# EAGLE design main (EAGLE 6.3)
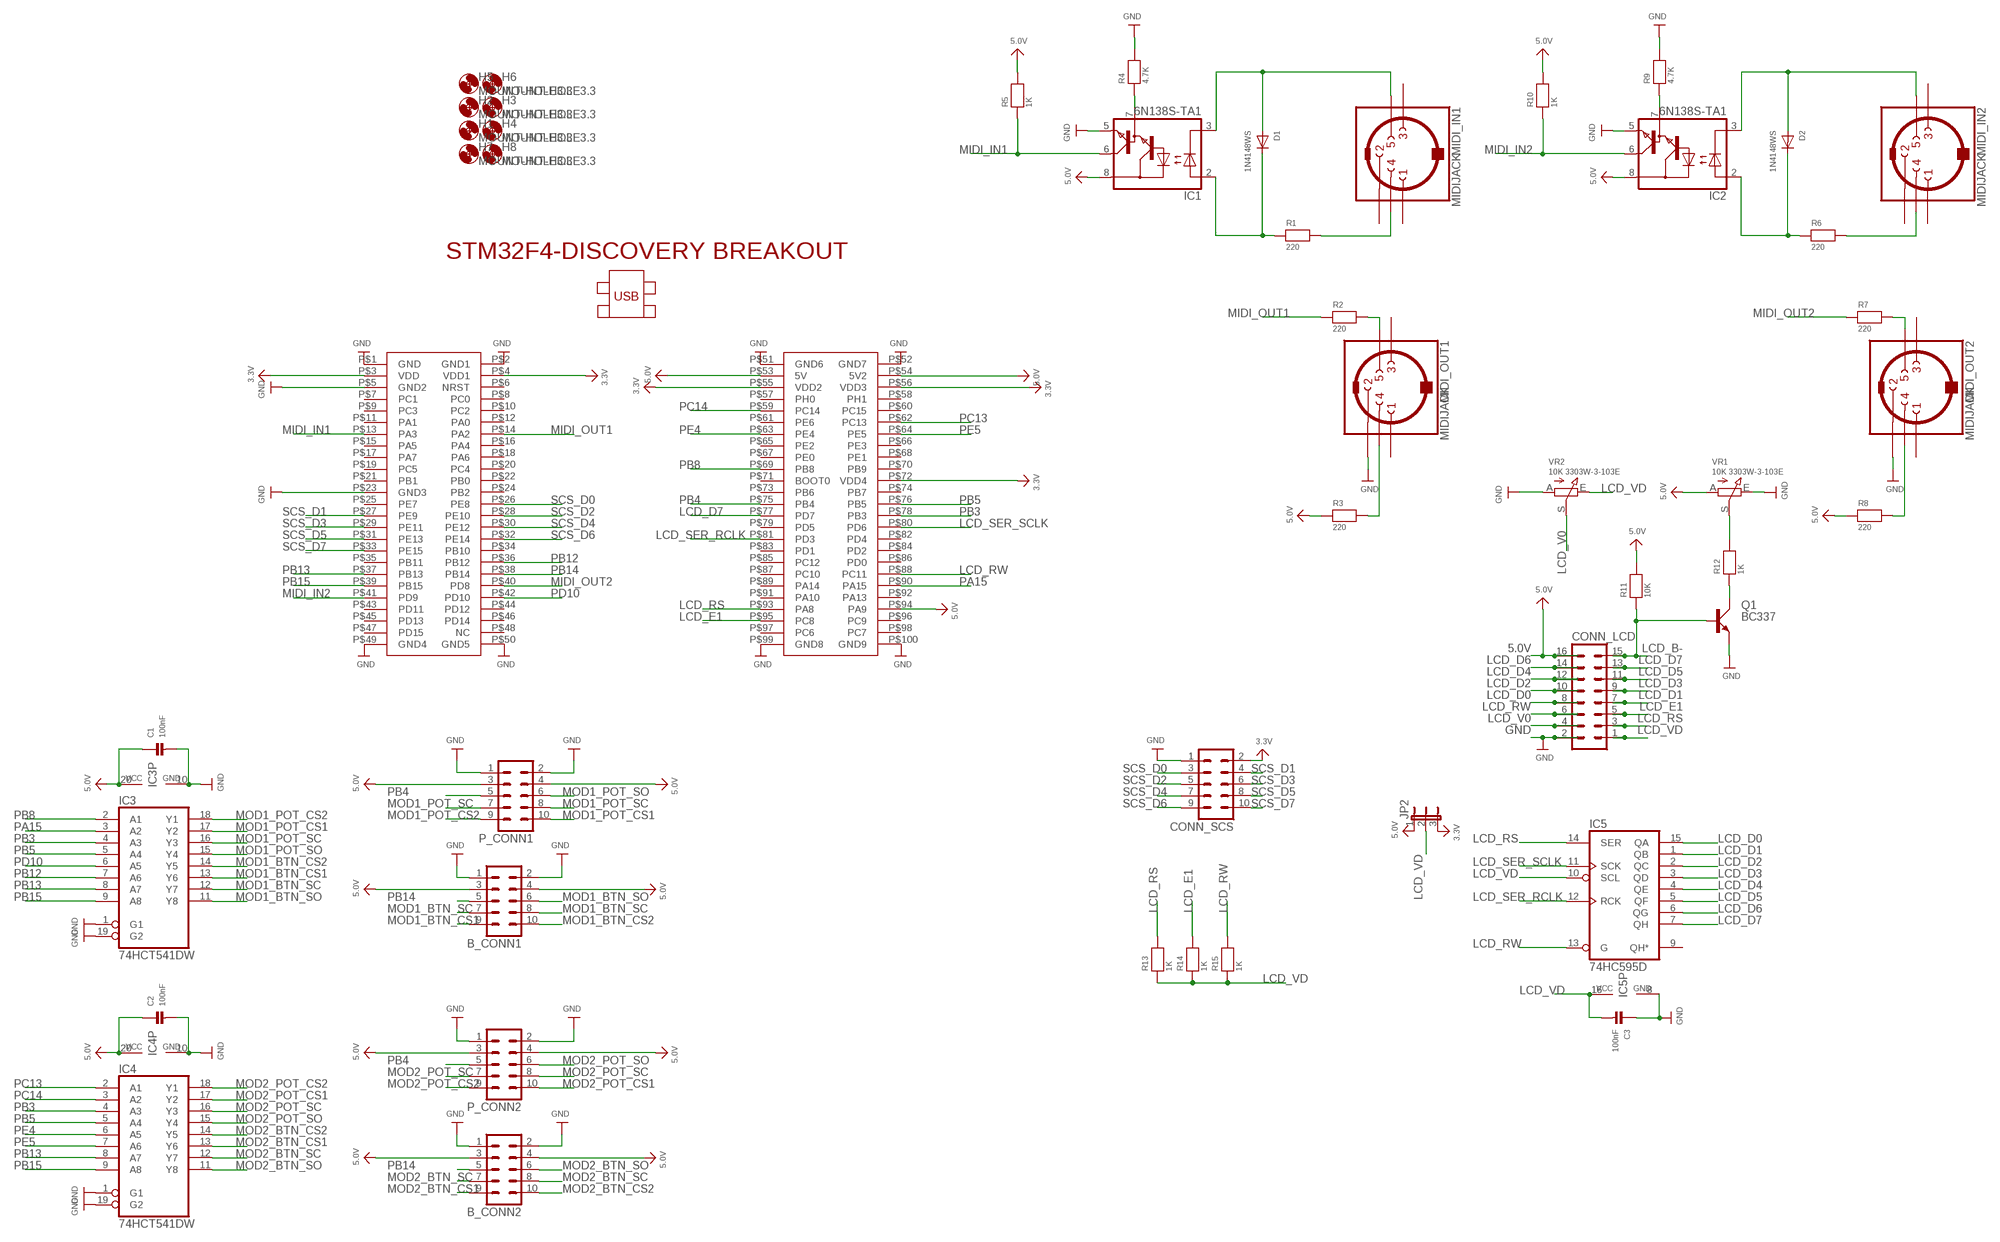
[diagram p0: schematic, sheet 1]

## Parts
B_CONN1  ML10  [ML10]
B_CONN2  ML10  [ML10]
C1  100nF  CAP_CERAMIC0603  [0603]
C2  100nF  CAP_CERAMIC0603  [0603]
C3  100nF  CAP_CERAMIC0603  [0603]
CONN_LCD  ML16  [ML16]
CONN_SCS  ML10  [ML10]
D1  1N4148WS  DIODESOD-323  [SOD-323]
D2  1N4148WS  DIODESOD-323  [SOD-323]
H1  MOUNT-HOLE3.3  [3,3]
H2  MOUNT-HOLE3.3  [3,3]
H3  MOUNT-HOLE3.3  [3,3]
H4  MOUNT-HOLE3.3  [3,3]
H5  MOUNT-HOLE3.3  [3,3]
H6  MOUNT-HOLE3.3  [3,3]
H7  MOUNT-HOLE3.3  [3,3]
H8  MOUNT-HOLE3.3  [3,3]
IC1  6N138S-TA1  6N138SMD  [SO8-GW300]
IC2  6N138S-TA1  6N138SMD  [SO8-GW300]
IC3  74HCT541DW  [SO20W]
IC4  74HCT541DW  [SO20W]
IC5  74HC595D  [SO16]
JP2  JUMPER3  [JUMPER3]
MIDI_IN1  MIDIJACK  [CP-2350]
MIDI_IN2  MIDIJACK  [CP-2350]
MIDI_OUT1  MIDIJACK  [CP-2350]
MIDI_OUT2  MIDIJACK  [CP-2350]
P_CONN1  ML10  [ML10]
P_CONN2  ML10  [ML10]
Q1  BC337  [SOT54A]
R1  220  RESISTOR_0603  [_0603]
R2  220  RESISTOR_0603  [_0603]
R3  220  RESISTOR_0603  [_0603]
R4  4.7K  RESISTOR_0603  [_0603]
R5  1K  RESISTOR_0603  [_0603]
R6  220  RESISTOR_0603  [_0603]
R7  220  RESISTOR_0603  [_0603]
R8  220  RESISTOR_0603  [_0603]
R9  4.7K  RESISTOR_0603  [_0603]
R10  1K  RESISTOR_0603  [_0603]
R11  10K  RESISTOR_0603  [_0603]
R12  1K  RESISTOR_0603  [_0603]
R13  1K  RESISTOR_0603  [_0603]
R14  1K  RESISTOR_0603  [_0603]
R15  1K  RESISTOR_0603  [_0603]
U$1  STM32F4-DISCOVERY  [STM32F4-DISCOVERY]
VR1  10K 3303W-3-103E  TRIMPOT10K_BOURNS  [TRIMPOT_BOURNS3MM]
VR2  10K 3303W-3-103E  TRIMPOT10K_BOURNS  [TRIMPOT_BOURNS3MM]

## Nets
3.3V: CONN_SCS.2 JP2.3 U$1.P$3(VDD) U$1.P$4(VDD1) U$1.P$55(VDD2) U$1.P$56(VDD3) U$1.P$72(VDD4)
5.0V: B_CONN1.3 B_CONN1.4 B_CONN2.3 B_CONN2.4 C1.1 C2.1 CONN_LCD.16 IC1.8(VCC) IC2.8(VCC) IC3.20(VCC) IC4.20(VCC) JP2.1 P_CONN1.3 P_CONN1.4 P_CONN2.3 P_CONN2.4 R3.1 R5.2 R8.1 R10.2 R11.2 U$1.P$53(5V) U$1.P$54(5V2) U$1.P$94(PA9) VR1.A
GND: B_CONN1.1 B_CONN1.2 B_CONN2.1 B_CONN2.2 C1.2 C2.2 C3.1 CONN_LCD.2 CONN_SCS.1 IC1.5(GND) IC2.5(GND) IC3.1(G1) IC3.10(GND) IC3.19(G2) IC4.1(G1) IC4.10(GND) IC4.19(G2) IC5.8(GND) MIDI_OUT1.2 MIDI_OUT2.2 P_CONN1.1 P_CONN1.2 P_CONN2.1 P_CONN2.2 Q1.E R4.2 R9.2 U$1.P$1(GND) U$1.P$2(GND1) U$1.P$5(GND2) U$1.P$23(GND3) U$1.P$49(GND4) U$1.P$50(GND5) U$1.P$51(GND6) U$1.P$52(GND7) U$1.P$99(GND8) U$1.P$100(GND9) VR1.E VR2.A
LCD_B-: CONN_LCD.15 Q1.B R11.1
LCD_D0: CONN_LCD.8 IC5.15(QA)
LCD_D1: CONN_LCD.7 IC5.1(QB)
LCD_D2: CONN_LCD.10 IC5.2(QC)
LCD_D3: CONN_LCD.9 IC5.3(QD)
LCD_D4: CONN_LCD.12 IC5.4(QE)
LCD_D5: CONN_LCD.11 IC5.5(QF)
LCD_D6: CONN_LCD.14 IC5.6(QG)
LCD_D7: CONN_LCD.13 IC5.7(QH) U$1.P$77(PD7)
LCD_E1: CONN_LCD.5 R14.2 U$1.P$95(PC8)
LCD_RS: CONN_LCD.3 IC5.14(SER) R13.2 U$1.P$93(PA8)
LCD_RW: CONN_LCD.6 IC5.13(G) R15.2 U$1.P$88(PC11)
LCD_SER_RCLK: IC5.12(RCK) U$1.P$81(PD3)
LCD_SER_SCLK: IC5.11(SCK) U$1.P$80(PD6)
LCD_V0: CONN_LCD.4 VR2.S
LCD_VD: C3.2 CONN_LCD.1 IC5.10(SCL) IC5.16(VCC) JP2.2 R13.1 R14.1 R15.1 VR2.E
MIDI_IN1: IC1.6(VO) R5.1 U$1.P$13(PA3)
MIDI_IN2: IC2.6(VO) R10.1 U$1.P$41(PD9)
MIDI_OUT1: R2.1 U$1.P$14(PA2)
MIDI_OUT2: R7.1 U$1.P$40(PD8)
MOD1_BTN_CS1: B_CONN1.9 IC3.13(Y6)
MOD1_BTN_CS2: B_CONN1.10 IC3.14(Y5)
MOD1_BTN_SC: B_CONN1.7 B_CONN1.8 IC3.12(Y7)
MOD1_BTN_SO: B_CONN1.6 IC3.11(Y8)
MOD1_POT_CS1: IC3.17(Y2) P_CONN1.10
MOD1_POT_CS2: IC3.18(Y1) P_CONN1.9
MOD1_POT_SC: IC3.16(Y3) P_CONN1.7 P_CONN1.8
MOD1_POT_SO: IC3.15(Y4) P_CONN1.6
MOD2_BTN_CS1: B_CONN2.9 IC4.13(Y6)
MOD2_BTN_CS2: B_CONN2.10 IC4.14(Y5)
MOD2_BTN_SC: B_CONN2.7 B_CONN2.8 IC4.12(Y7)
MOD2_BTN_SO: B_CONN2.6 IC4.11(Y8)
MOD2_POT_CS1: IC4.17(Y2) P_CONN2.10
MOD2_POT_CS2: IC4.18(Y1) P_CONN2.9
MOD2_POT_SC: IC4.16(Y3) P_CONN2.7 P_CONN2.8
MOD2_POT_SO: IC4.15(Y4) P_CONN2.6
N$1: MIDI_OUT1.5 R2.2
N$2: MIDI_OUT1.4 R3.2
N$3: MIDI_IN1.4 R1.2
N$4: D1.C IC1.2(A) R1.1
N$5: D1.A IC1.3(C) MIDI_IN1.5
N$6: IC1.7(VB) R4.1
N$7: Q1.C R12.1
N$8: MIDI_OUT2.5 R7.2
N$9: MIDI_OUT2.4 R8.2
N$10: MIDI_IN2.4 R6.2
N$11: D2.C IC2.2(A) R6.1
N$12: D2.A IC2.3(C) MIDI_IN2.5
N$13: IC2.7(VB) R9.1
N$14: R12.2 VR1.S
PA15: IC3.3(A2) U$1.P$90(PA15)
PB3: IC3.4(A3) IC4.4(A3) U$1.P$78(PB3)
PB4: P_CONN1.5 P_CONN2.5 U$1.P$75(PB4)
PB5: IC3.5(A4) IC4.5(A4) U$1.P$76(PB5)
PB8: IC3.2(A1) U$1.P$69(PB8)
PB12: IC3.7(A6) U$1.P$36(PB12)
PB13: IC3.8(A7) IC4.8(A7) U$1.P$37(PB13)
PB14: B_CONN1.5 B_CONN2.5 U$1.P$38(PB14)
PB15: IC3.9(A8) IC4.9(A8) U$1.P$39(PB15)
PC13: IC4.2(A1) U$1.P$62(PC13)
PC14: IC4.3(A2) U$1.P$59(PC14)
PD10: IC3.6(A5) U$1.P$42(PD10)
PE4: IC4.6(A5) U$1.P$63(PE4)
PE5: IC4.7(A6) U$1.P$64(PE5)
SCS_D0: CONN_SCS.3 U$1.P$26(PE8)
SCS_D1: CONN_SCS.4 U$1.P$27(PE9)
SCS_D2: CONN_SCS.5 U$1.P$28(PE10)
SCS_D3: CONN_SCS.6 U$1.P$29(PE11)
SCS_D4: CONN_SCS.7 U$1.P$30(PE12)
SCS_D5: CONN_SCS.8 U$1.P$31(PE13)
SCS_D6: CONN_SCS.9 U$1.P$32(PE14)
SCS_D7: CONN_SCS.10 U$1.P$33(PE15)
Unconnected: IC5.9(QH*) MIDI_IN1.1 MIDI_IN1.2 MIDI_IN1.3 MIDI_IN2.1 MIDI_IN2.2 MIDI_IN2.3 MIDI_OUT1.1 MIDI_OUT1.3 MIDI_OUT2.1 MIDI_OUT2.3 U$1.P$6(NRST) U$1.P$7(PC1) U$1.P$8(PC0) U$1.P$9(PC3) U$1.P$10(PC2) U$1.P$11(PA1) U$1.P$12(PA0) U$1.P$15(PA5) U$1.P$16(PA4) U$1.P$17(PA7) U$1.P$18(PA6) U$1.P$19(PC5) U$1.P$20(PC4) U$1.P$21(PB1) U$1.P$22(PB0) U$1.P$24(PB2) U$1.P$25(PE7) U$1.P$34(PB10) U$1.P$35(PB11) U$1.P$43(PD11) U$1.P$44(PD12) U$1.P$45(PD13) U$1.P$46(PD14) U$1.P$47(PD15) U$1.P$48(NC) U$1.P$57(PH0) U$1.P$58(PH1) U$1.P$60(PC15) U$1.P$61(PE6) U$1.P$65(PE2) U$1.P$66(PE3) U$1.P$67(PE0) U$1.P$68(PE1) U$1.P$70(PB9) U$1.P$71(BOOT0) U$1.P$73(PB6) U$1.P$74(PB7) U$1.P$79(PD5) U$1.P$82(PD4) U$1.P$83(PD1) U$1.P$84(PD2) U$1.P$85(PC12) U$1.P$86(PD0) U$1.P$87(PC10) U$1.P$89(PA14) U$1.P$91(PA10) U$1.P$92(PA13) U$1.P$96(PC9) U$1.P$97(PC6) U$1.P$98(PC7)

## Library data of the parts
B_CONN1 B_CONN2 CONN_SCS P_CONN1 P_CONN2 = con-harting-ml:ML10: HARTING; OC_FARNELL: unknown; OC_NEWARK: unknown
C1-C3 = microbuilder:CAP_CERAMIC: Ceramic Capacitors 0402 - 0402 Surface Mount Capacitors 16pF 50V 5% [Digikey: 445-4899-2-ND] 18pF 50V 5% [Digikey: 490-1281-2-ND] 22pF 50V 5% [Digikey: 490-1283-2-ND] 68pF 50V 5% [Digikey: 490-1289-2-ND] 0.1uF 10V 10% [Digikey: 490-1318-2-ND] 1.0uF 6.3V 10% [Digikey: 490-1320-2-ND] 0603 - 0603 Surface Mount Capacitors 16 pF 50V 5% [Digikey: 445-5051-2-ND] 22 pF 50V [Digikey: PCC220ACVTR-ND] 33 pF 50V 5% [Digikey: 490-1415-1-ND] 56pF 50V 5% [Digikey: 490-1421-1-ND] 220pF 50V 5% [Digikey: 445-1285-1-ND] 680 pF 50V 2200 pF 50V 5% C0G [Digikey: 445-1297-1-ND] 5600 pF 100V 5% X7R [Digikey: 478-3711-1-ND] 0.1 µF 25V 10% [Digikey: PCC2277TR-ND] 0.22 µF 16V 10% X7R [Digikey: 445-1318-1-ND] 1.0 µF 25V 10% [Digikey: 445-5146-2-ND] 0603 - RF Specific 3pF 250V +/-0.1pF RF [Digikey: 712-1347-1-ND] 18 pF 250V 5% [Digikey: 478-3505-1-ND or 712-1322-1-ND] 56 pF 250V 5% C0G RF [Digikey: 490-4867-1-ND] 68 pF 250V RF [Digikey: 490-4868-1-ND] 0805 - 0805 Surface Mount Capacitors 220 pF 250V 2% RF Ceramic Capacitor [Digikey: 712-1398-1-ND] 1000 pF 50V 2% NP0 Ceramic Capacitor [Digikey: 478-3760-1-ND] 0.1 µF 25V 10% Ceramic Capacitor [Digikey: PCC1828TR-ND] 1.0 µF 16V 10% Ceramic Capacitor[Digikey: 490-1691-2-ND] 10.0 µF 10V 10% Ceramic Capacitor[Digikey: 709-1228-1-ND] 10.0 uF 16V 10% Ceramic Capacitor [Digikey: 478-5165-2-ND] 47 uF 6.3V 20% Ceramic Capacitor [Digikey: 587-1779-1-ND or 399-5506-1-ND] 1206 - 1206 Surface Mount Capacitors 47uF 10V 20% Ceramic Capacitor [Digikey: 490-5528-1-ND or 399-5508-1-ND or 445-6010-1-ND] 100uF 6.3V -20%, +80% Y5V Ceramic Capacitor (Digikey: 490-4512-1-ND, Mouser: 81-GRM31CF50J107ZE1L)
CONN_LCD = con-harting-ml:ML16: HARTING; OC_FARNELL: unknown; OC_NEWARK: unknown
D1 D2 = microbuilder:DIODE: Diode SMA Model Volts Amps Type Vf Vr Digikey # Notes SSA34-E3 40V 3A Schottky 480mV @ 3A 200uA @ 40V SSA34-E3/61TGITR-ND CDBA120-G 20V 1A Schottky 500mV @ 1A 500uA @ 20V 641-1014-6-ND REEL MBRA210 10V 2A Schottky 350mV @ 2A 700uA @ 10V MBRA210LT3 SOD-123 Model Volts Amps Type Vf Vr Order # Notes BAT54T1G 30V 200mA Schottky 800mV @ 200mA 2uA @ 25V BAT54T1GOSTR-ND B0530W 30V 500mA Schottky 430mV @ 500mA 130uA @ 30V B0530W-FDICT-ND REEL MBR120 1A 20V Schottky 340mV @ 1A MBR120VLSFT1GOSCT-ND SOD-323 Model Volts Amps Type Vf Vr Order # Notes PMEG2005EJ 20V 500mA Schottky 355mV @ 500mA 568-4110-1-ND ZLLS410 10V 570mA Schottky 380mV @ 570mA ZLLS410CT-ND 1N4148WS 75V 150mA Silicon/Simple 1V 1N4148WSFSCT-ND REEL SOD-523 Model Volts Amps Type Vf Vr Order # Notes BAT54XV2 30V 200mA Schottky 0.8V @ 100mA BAT54XV2CT-ND TB751S 30V 30mA Schottky RB751S-40TE61CT-ND SOT23-R/W (R = Solder Paste/Reflow Ovens, W = Hand-Soldering) Model Volts Amps Type Vf Vr Order # Notes BAT54FILM 40V 300mA Schottky 497-7162-1-ND
H1-H8 = holes:MOUNT-HOLE: MOUNTING HOLE with drill center marker
IC1 IC2 = 6n138:6N138: MOTOROLA OPTO COUPLER
IC3 IC4 = 74xx-eu:74*541: Octal BUFFER and LINE DRIVER, 3-state
IC5 = 74xx-eu:74*595: 8-bit SHIFT REGISTER, output latch
JP2 = microbuilder:JUMPER3: JUMPER - 3 Pins
MIDI_IN1 MIDI_IN2 MIDI_OUT1 MIDI_OUT2 = keves:MIDIJACK: DIN 5 jack also known as MIDI jack A modification of conn-hirshman:MAB5SH with two options for the grounding 'teeth'
Q1 = transistor-small-signal:BC337: NPN TRANSISTOR
R1-R15 = microbuilder:RESISTOR: Resistors 0402 - 0402 Surface Mount Package 22 Ohm 1% 1/16W [Digikey: 311-22.0LRTR-ND] 33 Ohm 5% 1/16W 1.0K 5% 1/16W 1.5K 5% 1/16W 2.0K 1% 1/16W 10.0K 1% 1/16W [Digikey: 311-10.0KLRTR-ND] 10.0K 5% 1/16W [Digikey: RMCF0402JT10K0TR-ND] 12.1K 1% 1/16W [Digikey: 311-22.0LRTR-ND] 100.0K 5% 1/16W 0603 - 0603 Surface Mount Package 0 Ohm 1/10 Watt 1% Resistor 15 Ohm 1/10 Watt 1% Resistor 33 Ohm 1/10 Watt 1% Resistor 49.9 Ohm 1/10 Watt 1% Resistor 100 Ohm 1/10 Watt 1% Resistor 150 Ohm 1/10 Watt 1% Resistor 240 Ohm 1/10 Watt 1% Resistor 390 Ohm 1/10 Watt 1% Resistor 560 Ohm 1/10 Watt 1% Resistor 680 Ohm 1/10 Watt 1% Resistor 750 Ohm 1/10 Watt 1% Resistor 1.0K Ohm 1/10 Watt 1% Resistor 1.5K Ohm 1/10 Watt 1% Resistor 2.0K Ohm 1/10 Watt 1% Resistor 2.2K Ohm 1/10 Watt 1% Resistor 3.3K Ohm 1/10 Watt 1% Resistor 4.7K Ohm 1/10 Watt 1% Resistor 10.0K Ohm 1/10 Watt 1% Resistor 12.0K Ohm 1/10 Watt 1% Resistor 12.1K Ohm 1/10 Watt 1% Resistor 20.0K Ohm 1/10 Watt 1% Resistor 33.0K Ohm 1/10 Watt 1% Resistor 100.0K Ohm 1/10 Watt 1% Resistor 0805 - 0805 Surface Mount Package 0 Ohm 1/8 Watt 1% Resistor 33 Ohm 1/8 Watt 1% Resistor 100 Ohm 1/8 Watt 1% Resistor 150 Ohm 1/8 Watt 1% Resistor 200 Ohm 1/8 Watt 1% Resistor 240 Ohm 1/8 Watt 1% Resistor 330 Ohm 1/8 Watt 1% Resistor 390 Ohm 1/8 Watt 1% Resistor 470 Ohm 1/8 Watt 1% Resistor 1.0K Ohm 1/8 Watt 1% Resistor 1.5K Ohm 1/8 Watt 1% Resistor 2.0K Ohm 1/8 Watt 1% Resistor 4.7K Ohm 1/8 Watt 1% Resistor 5.1K Ohm 1/8 Watt 1% Resistor 5.6K Ohm 1/8 Watt 1% Resistor 10.0K Ohm 1/8 Watt 1% Resistor 22.0K Ohm 1/8 Watt 1% Resistor 33.0K Ohm 1/8 Watt 1% Resistor 100K Ohm 1/8 Watt 1% Resistor 1206 - 1206 Surface Mount Package 2012 - 2010 Surface Mount Package 0.11 Ohm 1/2 Watt 1% Resistor - Digikey: RHM.11UCT-ND
U$1 = STM32F4-DISCOVERY:STM32F4-DISCOVERY
VR1 VR2 = microbuilder:TRIMPOT: Potentiometers 3mm 10K Single Turn - Digikey: 3303W-103ETR-ND 3mm 100K Single Turn - Digikey: 3303X-104ETR-ND

## Board
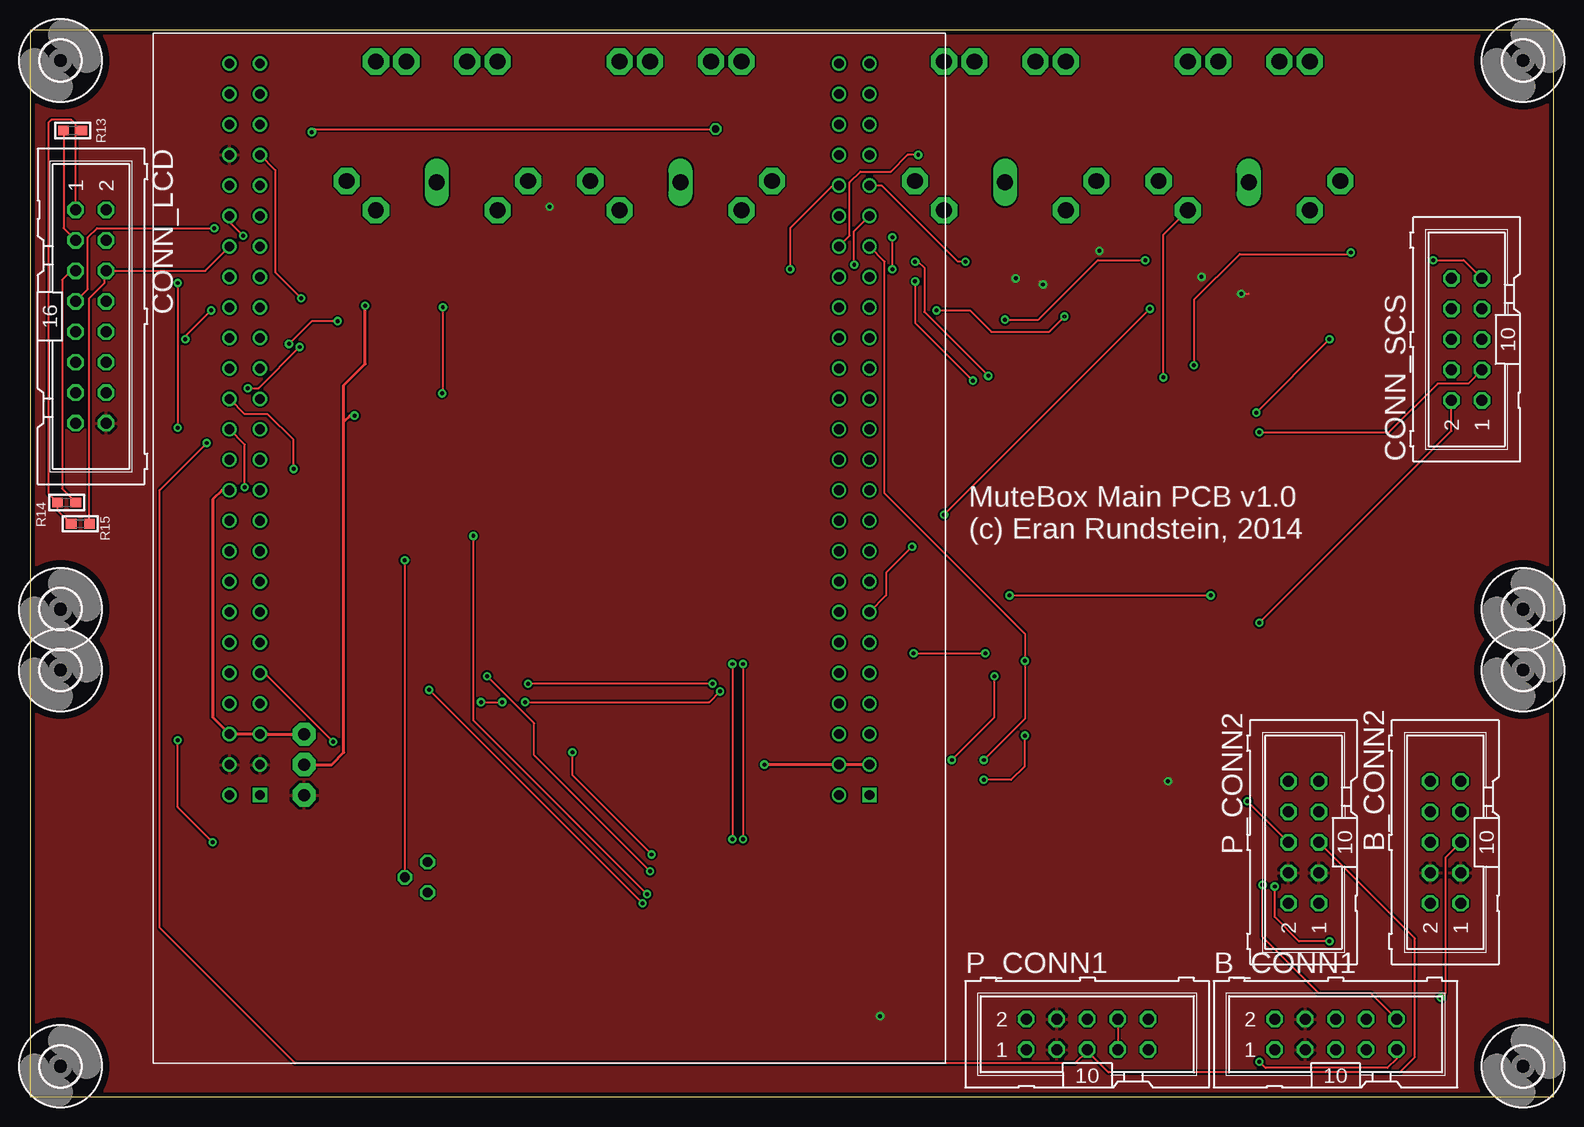
[diagram p1: board, top side]
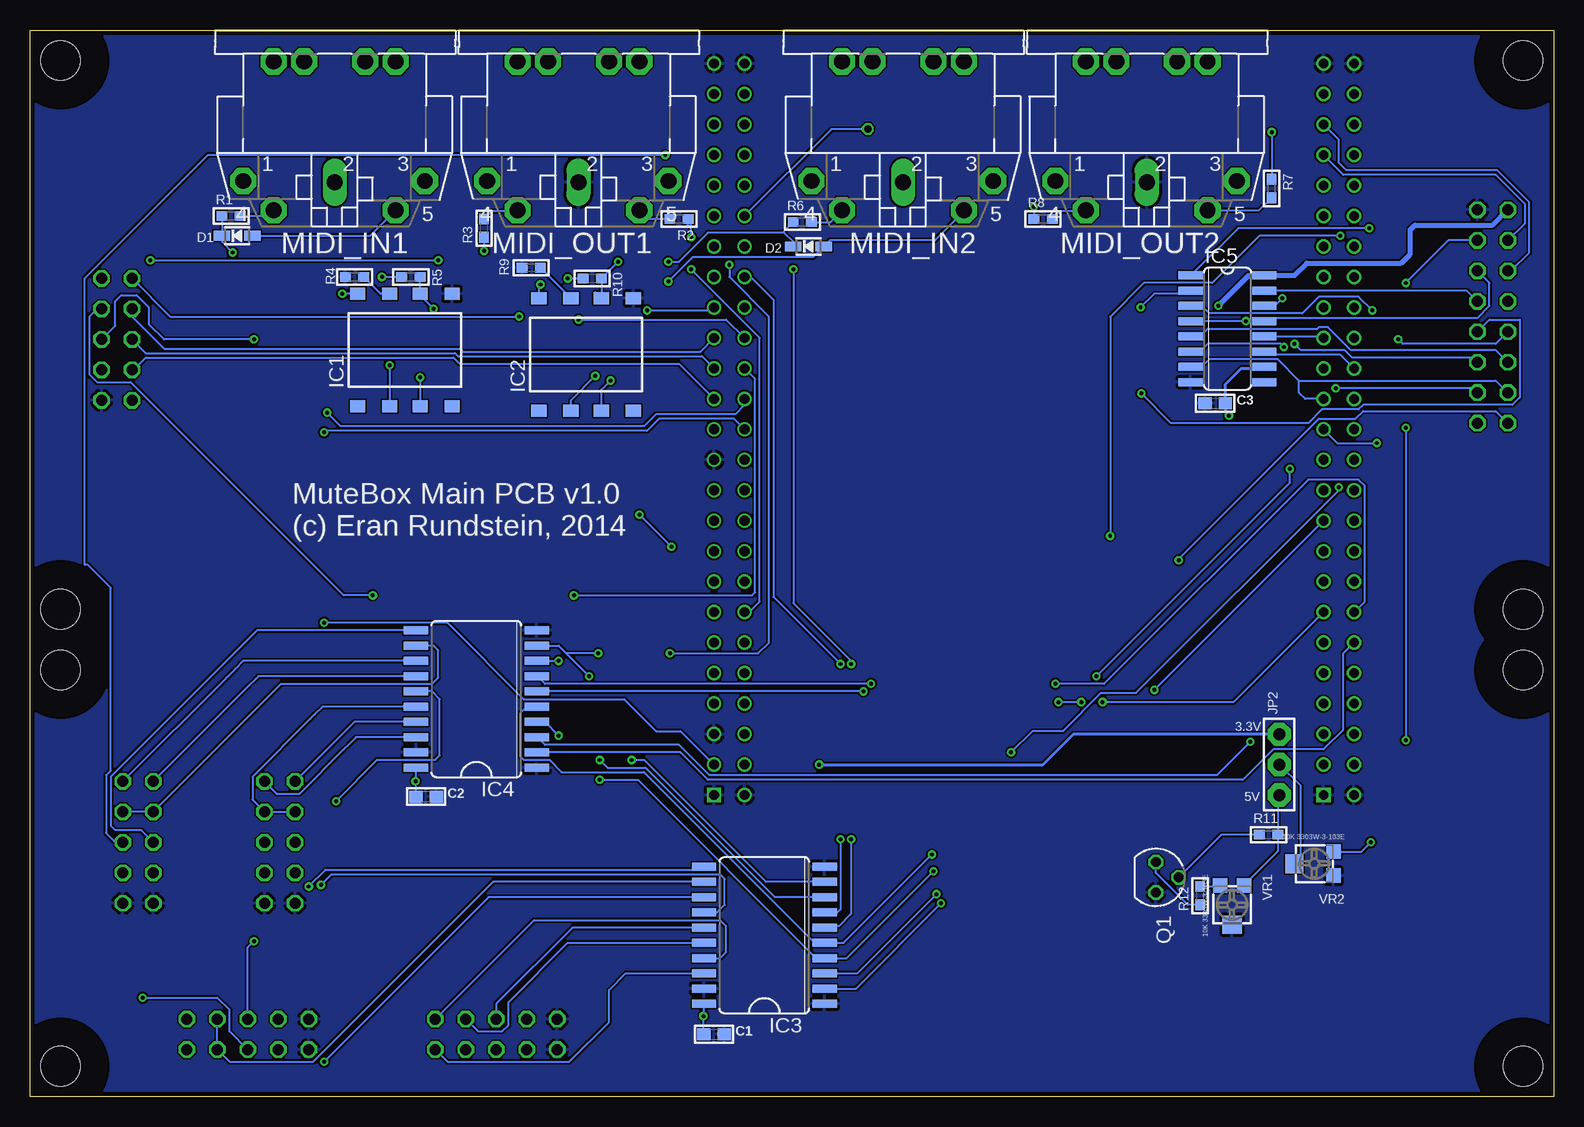
[diagram p2: board, bottom side, seen from below]

Size 127 x 88.9 mm. Coordinates in mm from the lower left corner, seen from the top.
Outline: 0,0 127,0 127,88.9 0,88.9 0,0
Copper layers (1*16): Top 0.0356mm / dielectric 1.5011mm / Bottom 0.0356mm
Design rules "oshpark_2layer *": minimum track width 6mil, minimum drill 13mil, track to track 6mil, track to pad 6mil, pad to pad 6mil, via to via 6mil, smd to smd 6mil, copper to edge 15mil, drill to drill 6mil, minimum pad ring 7mil, minimum via ring 7mil, stop-mask expansion 3mil, vias tented up to drill 0mil, thermal gap 10mil

### Footprints (pad centres in the part's own frame; a part is rotated, then mirrored left to right if it is on the bottom)
ML10 = drill 0.914 octagon: 1 -5.08,-1.27; 2 -5.08,1.27; 3 -2.54,-1.27; 4 -2.54,1.27; 5 0,-1.27; 6 0,1.27; 7 2.54,-1.27; 8 2.54,1.27; 9 5.08,-1.27; 10 5.08,1.27
0603 = smd 1.1 x 1: 1 -0.85,0; 2 0.85,0
ML16 = drill 0.914 octagon: 1 -8.89,-1.27; 2 -8.89,1.27; 3 -6.35,-1.27; 4 -6.35,1.27; 5 -3.81,-1.27; 6 -3.81,1.27; 7 -1.27,-1.27; 8 -1.27,1.27; 9 1.27,-1.27; 10 1.27,1.27; 11 3.81,-1.27; 12 3.81,1.27; 13 6.35,-1.27; 14 6.35,1.27; 15 8.89,-1.27; 16 8.89,1.27
SOD-323 = smd 1.35 x 0.8: A 1.27,0; C -1.27,0
3,3 = hole 3.3: 0,0
SO8-GW300 = smd 1 x 1.27: 1 -4.69,3.937; 2 -4.69,1.27; 3 -4.69,-1.27; 4 -4.69,-3.937; 5 4.69,-3.937; 6 4.69,-1.27; 7 4.69,1.27; 8 4.69,3.937
SO20W = smd 0.66 x 2.032: 1 -5.715,-5.029; 2 -4.445,-5.029; 3 -3.175,-5.029; 4 -1.905,-5.029; 5 -0.635,-5.029; 6 0.635,-5.029; 7 1.905,-5.029; 8 3.175,-5.029; 9 4.445,-5.029; 10 5.715,-5.029; 11 5.715,5.029; 12 4.445,5.029; 13 3.175,5.029; 14 1.905,5.029; 15 0.635,5.029; 16 -0.635,5.029; 17 -1.905,5.029; 18 -3.175,5.029; 19 -4.445,5.029; 20 -5.715,5.029
SO16 = smd 0.66 x 2.032: 1 -4.445,-3.073; 2 -3.175,-3.073; 3 -1.905,-3.073; 4 -0.635,-3.073; 5 0.635,-3.073; 6 1.905,-3.073; 7 3.175,-3.073; 8 4.445,-3.073; 9 4.445,3.073; 10 3.175,3.073; 11 1.905,3.073; 12 0.635,3.073; 13 -0.635,3.073; 14 -1.905,3.073; 15 -3.175,3.073; 16 -4.445,3.073
JUMPER3 = drill 1 pad 1.93 octagon: 1 -2.54,0; 2 0,0; 3 2.54,0
CP-2350 = drill 1.321 pad 2.184 octagon: 1 7.62,12.58; 3 -7.52,12.58; 4 5.08,15.02; 5 -5.08,15.02; PE -2.54,2.62; PE1 -5.08,2.62; PE2 5.08,2.62; PE@ 2.54,2.62 | drill 1.321 long: 2 0,12.68
SOT54A = drill 0.813 octagon: B 0,1.905; C -1.27,0; E 1.27,0
_0603 = smd 0.9 x 0.8: 1 -0.762,0; 2 0.762,0
STM32F4-DISCOVERY = drill 0.8 square: P$1 -26.67,30.48; P$51 24.13,30.48 | drill 0.8: P$2 -24.13,30.48; P$3 -26.67,27.94; P$4 -24.13,27.94; P$5 -26.67,25.4; P$6 -24.13,25.4; P$7 -26.67,22.86; P$8 -24.13,22.86; P$9 -26.67,20.32; P$10 -24.13,20.32; P$11 -26.67,17.78; P$12 -24.13,17.78; P$13 -26.67,15.24; P$14 -24.13,15.24; P$15 -26.67,12.7; P$16 -24.13,12.7; P$17 -26.67,10.16; P$18 -24.13,10.16; P$19 -26.67,7.62; P$20 -24.13,7.62; P$21 -26.67,5.08; P$22 -24.13,5.08; P$23 -26.67,2.54; P$24 -24.13,2.54; P$25 -26.67,0; P$26 -24.13,0; P$27 -26.67,-2.54; P$28 -24.13,-2.54; P$29 -26.67,-5.08; P$30 -24.13,-5.08; P$31 -26.67,-7.62; P$32 -24.13,-7.62; P$33 -26.67,-10.16; P$34 -24.13,-10.16; P$35 -26.67,-12.7; P$36 -24.13,-12.7; P$37 -26.67,-15.24; P$38 -24.13,-15.24; P$39 -26.67,-17.78; P$40 -24.13,-17.78; P$41 -26.67,-20.32; P$42 -24.13,-20.32; P$43 -26.67,-22.86; P$44 -24.13,-22.86; P$45 -26.67,-25.4; P$46 -24.13,-25.4; P$47 -26.67,-27.94; P$48 -24.13,-27.94; P$49 -26.67,-30.48; P$50 -24.13,-30.48; P$52 26.67,30.48; P$53 24.13,27.94; P$54 26.67,27.94; P$55 24.13,25.4; P$56 26.67,25.4; P$57 24.13,22.86; P$58 26.67,22.86; P$59 24.13,20.32; P$60 26.67,20.32; P$61 24.13,17.78; P$62 26.67,17.78; P$63 24.13,15.24; P$64 26.67,15.24; P$65 24.13,12.7; P$66 26.67,12.7; P$67 24.13,10.16; P$68 26.67,10.16; P$69 24.13,7.62; P$70 26.67,7.62; P$71 24.13,5.08; P$72 26.67,5.08; P$73 24.13,2.54; P$74 26.67,2.54; P$75 24.13,0; P$76 26.67,0; P$77 24.13,-2.54; P$78 26.67,-2.54; P$79 24.13,-5.08; P$80 26.67,-5.08; P$81 24.13,-7.62; P$82 26.67,-7.62; P$83 24.13,-10.16; P$84 26.67,-10.16; P$85 24.13,-12.7; P$86 26.67,-12.7; P$87 24.13,-15.24; P$88 26.67,-15.24; P$89 24.13,-17.78; P$90 26.67,-17.78; P$91 24.13,-20.32; P$92 26.67,-20.32; P$93 24.13,-22.86; P$94 26.67,-22.86; P$95 24.13,-25.4; P$96 26.67,-25.4; P$97 24.13,-27.94; P$98 26.67,-27.94; P$99 24.13,-30.48; P$100 26.67,-30.48
TRIMPOT_BOURNS3MM = smd 1.2 x 1.2: A -1,-1.6; S 1,-1.6 | smd 1.6 x 1.5: E 0,1.65

### Placement (x,y rotation side)
B_CONN1  108.84,5.21 0 top
B_CONN2  117.98,21.21 90 top
C1  69.98,5.21 0 bottom
C2  93.98,25.02 0 bottom
C3  28.19,57.78 0 bottom
CONN_LCD  5.08,65.02 270 top
CONN_SCS  119.76,63.12 90 top
D1  109.73,71.75 0 bottom
D2  62.1,70.87 0 bottom
H1  2.54,86.36 0 top
H2  124.46,86.36 0 top
H3  2.54,2.54 0 top
H4  124.46,2.54 0 top
H5  2.54,40.64 0 top
H6  124.46,40.64 0 top
H7  2.54,35.56 0 top
H8  124.46,35.56 0 top
IC1  95.76,62.23 90 bottom
IC2  80.64,61.85 90 bottom
IC3  65.79,13.46 90 bottom
IC4  89.79,33.15 90 bottom
IC5  27.18,64.01 270 bottom
JP2  22.86,27.69 90 bottom
MIDI_IN1  101.6,88.9 180 bottom
MIDI_IN2  54.23,88.9 180 bottom
MIDI_OUT1  81.28,88.9 180 bottom
MIDI_OUT2  33.91,88.9 180 bottom
P_CONN1  88.14,5.21 0 top
P_CONN2  106.17,21.21 90 top
Q1  33.15,18.29 270 bottom
R1  110.24,73.41 0 bottom
R2  72.9,73.15 180 bottom
R3  89.15,72.39 90 bottom
R4  99.95,68.33 180 bottom
R5  95.25,68.33 180 bottom
R6  62.61,72.9 0 bottom
R7  23.5,75.69 270 bottom
R8  42.55,73.15 0 bottom
R9  85.22,69.09 180 bottom
R10  80.14,68.2 180 bottom
R11  23.75,21.84 0 bottom
R12  29.46,16.76 90 bottom
R13  3.56,80.52 180 top
R14  3.05,49.53 0 top
R15  4.19,47.75 0 top
U$1  43.31,55.63 180 top
VR1  26.8,16 180 bottom
VR2  19.94,19.43 90 bottom

### Tracks (layer width: path | path; a pad name or v marks a point on that pad's centre or on a via)
3.3V  (via drill 0.33)
  Top 0.152: v102.49,39.5 118.49,55.5 CONN_SCS.2
  Top 0.254: JP2.3 U$1.P$55 U$1.P$56 15.24,31.62 15.24,49.78 16,50.55 U$1.P$72 | U$1.P$3 U$1.P$4 v61.21,27.69
  Bottom 0.152: v102.49,39.5 92.2,39.5 85.85,33.15 77.47,33.15 74.8,30.48 72.77,30.48 U$1.P$3 | U$1.P$55 19.05,30.23
  Bottom 0.254: JP2.3 40.01,30.23 42.55,27.69 v61.21,27.69
5.0V  (via drill 0.33)
  Top 0.152: v89.15,70.48 89.15,70.23 | v84.45,67.69 84.2,67.94 | v100.97,66.93 101.6,66.93
  Bottom 0.152: v82.17,68.2 R10.2 | IC3.20 70.87,7.75 v70.87,6.73 70.87,5.25 C1.1 | C2.1 94.87,25.02 v94.87,26.29 94.87,27.43 IC4.20 | v97.66,68.33 R5.2 | IC1.8 v100.97,66.93 | JP2.1 22.99,25.15 R11.2 22.99,20.45 25.8,17.64 VR1.A | v43.31,74.17 R8.1 | R3.1 v89.15,70.48 | IC2.8 84.58,67.56 v84.45,67.69
  pour Top: 0.25,88.65 126.75,88.65 126.75,0.25 0.25,0.25
GND
  pour Bottom: 0.25,88.65 126.75,88.65 126.75,0.25 0.25,0.25
LCD_B-  (via drill 0.33)
  Top 0.152: v31.24,44.7 Q1.B
  Bottom 0.152: CONN_LCD.15 4.83,57.15 15.88,57.15 16.51,56.52 19.56,56.52 31.24,44.83 v31.24,44.7 | R11.1 27.69,21.84 Q1.B
LCD_D0
  Bottom 0.152: IC5.15 7.24,67.18 CONN_LCD.8
LCD_D1  (via drill 0.33)
  Top 0.152: CONN_LCD.7 4.83,67.31 4.83,71.63 5.59,72.39 v15.37,72.39
  Bottom 0.152: IC5.1 30.23,68.45 26.29,72.39 v15.37,72.39
LCD_D2  (via drill 0.33)
  Top 0.152: v34.35,58.61 34.42,58.67 v34.42,65.79
  Bottom 0.152: CONN_LCD.10 5.33,64.77 2.79,64.77 2.79,58.29 3.43,57.66 15.88,57.66 16.26,57.28 19.3,57.28 20.45,56.13 31.88,56.13 v34.35,58.61 34.42,58.67 | IC5.2 30.35,67.18 30.61,66.93 33.27,66.93 v34.42,65.79 34.35,65.72 34.42,65.66
LCD_D3  (via drill 0.33)
  Top 0.152: v15.11,65.53 12.95,63.37 v12.95,63.12
  Bottom 0.152: v15.11,65.53 16.26,66.67 19.56,66.67 20.95,65.28 28.7,65.28 29.34,65.91 IC5.3 | v12.95,63.12 12.57,62.74 4.83,62.74 CONN_LCD.9
LCD_D4  (via drill 0.33)
  Top 0.152: v25.65,64.64 23.5,64.64 v21.59,62.74
  Bottom 0.152: v25.65,64.64 IC5.4 | v21.59,62.74 21.08,62.23 17.4,62.23 16.76,61.59 6.73,61.59 CONN_LCD.12
LCD_D5
  Bottom 0.152: CONN_LCD.11 4.83,62.23 16.89,62.23 18.8,64.14 19.56,64.14 19.68,64.01 28.83,64.01 29.46,63.37 IC5.5
LCD_D6  (via drill 0.33)
  Top 0.152: v22.48,62.48 19.05,59.05 v18.16,59.05
  Bottom 0.152: v22.48,62.48 22.73,62.74 28.83,62.74 29.46,62.1 IC5.6 | v18.16,59.05 6.73,59.05 CONN_LCD.14
LCD_D7
  Bottom 0.152: 21.21,59.69 22.99,61.47 28.7,61.47 29.34,60.83 IC5.7 | CONN_LCD.13 4.83,59.69 21.21,59.69 | U$1.P$77 20.7,58.17 21.21,58.67 21.21,59.69
LCD_E1
  Top 0.152: CONN_LCD.5 3.43,68.83 2.67,68.07 2.67,50.67 R14.2
  Bottom 0.152: CONN_LCD.5 3.56,68.83 2.03,70.36 2.03,74.55 4.7,77.22 17.27,77.22 17.91,77.85 17.91,79.76 U$1.P$95
LCD_RS  (via drill 0.33)
  Top 0.152: v22.61,66.55 20.45,68.71 20.45,77.22 U$1.P$93 | R13.2 2.79,72.39 CONN_LCD.3
  Bottom 0.152: U$1.P$93 17.53,76.83 4.83,76.83 2.41,74.42 2.41,72.77 CONN_LCD.3 | IC5.14 23.24,65.91 v22.61,66.55
LCD_RW
  Top 0.152: U$1.P$88 14.61,68.83 CONN_LCD.6 6.22,68.71 6.22,67.82 4.95,66.55 R15.2
  Bottom 0.152: IC5.13 24,64.64 23.75,64.9 6.35,64.9 5.33,65.91 5.33,67.82 CONN_LCD.6
LCD_SER_RCLK
  Bottom 0.152: IC5.12 19.3,63.37 U$1.P$81
LCD_SER_SCLK
  Bottom 0.152: U$1.P$80 17.78,61.85 23.75,61.85 24,62.1 IC5.11
LCD_V0  (via drill 0.33)
  Top 0.152: v15.24,21.21 12.32,24.13 v12.32,29.72 | v12.32,67.82 v12.32,55.75
  Bottom 0.152: v15.24,21.21 16.02,20.43 VR2.S | v12.32,55.75 v12.32,29.72 | CONN_LCD.4 8.76,71.37 v12.32,67.82
LCD_VD  (via drill 0.33)
  Top 0.152: CONN_LCD.1 3.81,80.64 | 3.81,80.64 3.81,81.03 3.43,81.41 1.78,81.41 1.52,81.15 1.52,50.29 R14.1 2.29,48.9 R15.1 | R13.1 3.94,80.52 3.81,80.64
  Top 0.254: JP2.2 25.15,27.69 26.16,28.7 26.16,56.26 | 26.16,56.26 26.16,59.31 27.94,61.09 v27.94,65.91 | v27.05,56.77 26.67,56.77 26.16,56.26
  Bottom 0.152: IC5.10 24.64,60.83 | 24,68.45 IC5.16 | VR2.E 21.08,19.94 21.08,25.91 JP2.2
  Bottom 0.254: 24.64,60.83 24.77,60.71 26.04,60.71 27.34,59.4 C3.2 27.34,57.06 v27.05,56.77
  Bottom 0.406: v27.94,65.91 25.4,68.45 IC5.16 | 24,68.45 21.59,68.45 20.57,69.47 12.7,69.47 11.94,70.23 11.94,72.26 11.56,72.64 5.08,72.64 CONN_LCD.1
MIDI_IN1  (via drill 0.33)
  Top 0.152: v93.34,65.66 v76.2,48.51 | v73.53,45.85 71.37,43.69 71.37,41.78 U$1.P$13
  Bottom 0.152: R5.1 IC1.6 94.49,66.8 v93.34,65.66 | v73.53,45.85 v76.2,48.51
MIDI_IN2  (via drill 0.33)
  Top 0.152: U$1.P$41 70.99,75.95 77.34,69.6 v77.98,69.6
  Bottom 0.152: 79.88,67.06 IC2.6 R10.1 v77.98,69.6
MIDI_OUT1  (via drill 0.33)
  Top 0.152: v71.88,68.96 v71.88,71.63
  Bottom 0.152: v71.88,68.96 66.17,63.25 66.17,41.27 67.06,40.39 U$1.P$14 | 72.14,72.64 R2.1 71.88,72.9 v71.88,71.63
MIDI_OUT2  (via drill 0.33, 0.6)
  Top 0.152: v57.15,80.64 23.75,80.64 v23.5,80.39
  Bottom 0.152: U$1.P$40 60.2,80.64 v57.15,80.64 | v23.5,80.39 R7.1
MOD1_BTN_CS1  (via drill 0.33)
  Top 0.152: v102.49,2.92 103,2.41 113.16,2.41 113.92,3.17 B_CONN1.9
  Bottom 0.152: v102.49,2.92 88.77,16.64 IC3.13
MOD1_BTN_CS2  (via drill 0.33)
  Top 0.152: B_CONN1.10 111.76,8.64 107.44,8.64 102.74,13.34 v102.74,17.65
  Bottom 0.152: v102.74,17.65 101.85,18.54 69.47,18.54 69.09,18.16 69.09,16 69.72,15.37 IC3.14
MOD1_BTN_SC
  Bottom 0.152: B_CONN1.8 B_CONN1.7 110.36,2.92 103.38,2.92 88.39,17.91 IC3.12
MOD1_BTN_SO  (via drill 0.33)
  Top 0.152: v108.33,12.95 105.79,12.95 103.76,14.99 v103.76,17.53
  Bottom 0.152: v108.33,12.95 108.84,12.45 B_CONN1.6 | v103.76,17.53 102.36,18.92 71.12,18.92 70.87,19.18 IC3.11
MOD1_POT_CS1
  Bottom 0.152: P_CONN1.10 84.96,14.73 69.47,14.73 68.96,14.22 68.96,12.06 69.47,11.56 IC3.17
MOD1_POT_CS2
  Bottom 0.152: P_CONN1.9 92.2,2.92 82.04,2.92 78.74,6.22 78.74,8.89 77.34,10.29 IC3.18 70.87,10.29
MOD1_POT_SC
  Top 0.152: P_CONN1.8 P_CONN1.7
  Bottom 0.152: P_CONN1.8 89.66,5.46 87.63,5.46 87.12,5.97 87.12,7.87 82.17,12.83 IC3.16 70.87,12.83
MOD1_POT_SO
  Bottom 0.152: IC3.15 81.79,14.1 88.14,7.75 P_CONN1.6
MOD2_BTN_CS1
  Bottom 0.152: B_CONN2.9 110.62,34.92 109.86,35.69 109.22,36.32 IC4.13
MOD2_BTN_CS2
  Bottom 0.152: B_CONN2.10 108.71,34.29 108.2,34.8 107.95,35.05 IC4.14
MOD2_BTN_SC
  Bottom 0.152: B_CONN2.7 B_CONN2.8 106.05,34.42 93.47,34.42 92.96,34.92 92.96,37.21 93.34,37.59 IC4.12
MOD2_BTN_SO
  Bottom 0.152: IC4.11 108.08,38.86 120.27,26.67 120.27,22.61 119.89,22.23 117.73,22.23 B_CONN2.6
MOD2_POT_CS1
  Bottom 0.152: P_CONN2.10 101.22,29.97 100.58,30.61 99.95,31.24 IC4.17
MOD2_POT_CS2
  Bottom 0.152: P_CONN2.9 106.43,25.27 104.52,25.27 100.84,28.96 100.46,29.34 99.82,29.97 IC4.18
MOD2_POT_SC
  Bottom 0.152: P_CONN2.8 P_CONN2.7 108.46,24.77 108.46,26.67 103.63,31.5 103.25,31.88 102.62,32.51 IC4.16
MOD2_POT_SO  (via drill 0.33)
  Top 0.152: P_CONN2.6 v101.47,24.64
  Bottom 0.152: v101.47,24.64 98.04,28.07 93.22,28.07 92.84,28.45 92.84,33.15 93.47,33.78 IC4.15 94.74,33.78
N$1
  Bottom 0.152: MIDI_OUT1.5 75.47,73.15 R2.2
N$2
  Bottom 0.152: R3.2 88.52,73.79 86.36,73.79 MIDI_OUT1.4
N$3
  Bottom 0.152: R1.2 107.15,73.41 MIDI_IN1.4
N$4  (via drill 0.33)
  Top 0.152: v97.03,60.96 97.03,66.42 100.84,70.23 109.98,70.23 v110.11,70.36
  Bottom 0.152: v97.03,60.96 IC1.2 | R1.1 D1.C 111,71.25 v110.11,70.36
N$5  (via drill 0.33)
  Top 0.152: v94.49,59.94 94.49,71.85 MIDI_IN1.5
  Bottom 0.152: v94.49,59.94 IC1.3 | D1.A 98.64,71.75 MIDI_IN1.5
N$6
  Bottom 0.152: IC1.7 97.78,66.92 R4.1
N$7
  Bottom 0.152: R12.1 30.48,16 33.15,18.67 Q1.C
N$8
  Bottom 0.152: MIDI_OUT2.5 24.55,73.88 R7.2
N$9
  Bottom 0.152: R8.2 41.15,73.79 38.99,73.79 MIDI_OUT2.4
N$10
  Bottom 0.152: R6.2 60.29,72.9 MIDI_IN2.4
N$11  (via drill 0.33)
  Top 0.152: v73.79,69.6 74.04,69.6 74.55,69.09 74.55,65.41 v79.88,60.07
  Bottom 0.152: 64.14,72.01 70.48,72.01 72.9,69.6 v73.79,69.6 | 63.25,72.9 R6.1 64.14,72.14 64.14,72.01 | IC2.2 81.92,58.04 v79.88,60.07 | D2.C 63.37,71.25 64.14,72.01
N$12  (via drill 0.33)
  Top 0.152: v73.79,67.94 73.79,64.52 v78.61,59.69
  Bottom 0.152: v73.79,67.94 71.75,69.98 61.72,69.98 D2.A 60.33,71.37 51.56,71.37 49.15,73.79 MIDI_IN2.5 | IC2.3 79.38,58.93 v78.61,59.69
N$13
  Bottom 0.152: IC2.7 R9.1
N$14
  Bottom 0.152: 27.81,17.65 27.81,17.62 VR1.S 27.87,17.53 R12.2
PA15  (via drill 0.33)
  Top 0.152: v36.96,46.74 36.96,31.37 v51.44,16.89 | U$1.P$90 16.64,72.9 v17.78,71.75
  Bottom 0.152: v36.96,46.74 36.96,65.02 34.16,67.82 28.45,67.82 24.51,71.75 v17.78,71.75 | IC3.3 58.04,10.29 v51.44,16.89
PB3  (via drill 0.33)
  Top 0.152: U$1.P$78 17.91,56.9 19.81,56.9 21.97,54.74 v21.97,52.32 | v38.1,35.05 42.04,31.11 42.04,28.45 v51.69,18.8 | v79.5,26.42 81.79,26.42 82.93,27.56 v82.93,30.1
  Bottom 0.152: v79.5,26.42 76.33,26.42 61.47,11.56 IC3.4 58.93,11.56 v51.69,18.8 | v38.1,35.05 21.97,51.18 v21.97,52.32 | IC4.4 84.07,31.24 v82.93,30.1
PB4  (via drill 0.33)
  Top 0.152: 88.14,3.81 89.92,2.03 114.17,2.03 115.44,3.3 115.44,13.21 112.52,16.13 111.82,16.83 P_CONN2.5 | 88.14,3.81 P_CONN1.5 | 88.14,3.81 87.12,2.79 22.1,2.79 10.79,14.1 10.79,50.55 v14.73,54.48
  Bottom 0.152: U$1.P$75 18.03,54.48 v14.73,54.48
PB5  (via drill 0.33)
  Top 0.152: U$1.P$76 17.91,54.36 v17.91,50.8 | v51.82,20.19 45.21,26.8 v45.21,28.7
  Bottom 0.152: v51.82,20.19 59.18,12.83 IC3.5 61.59,12.83 75.82,27.05 82.68,27.05 83.69,28.07 85.85,28.07 86.11,28.32 86.11,32 85.6,32.51 IC4.5 | v45.21,28.7 43.43,30.48 40.89,30.48 37.72,33.66 34.8,33.66 17.91,50.55 v17.91,50.8
PB8  (via drill 0.33)
  Top 0.152: v33.27,33.91 v51.05,16.13
  Bottom 0.152: v51.05,16.13 58.17,9.02 IC3.2 | U$1.P$69 v33.27,33.91
PB12  (via drill 0.33)
  Top 0.152: v59.44,36.07 v59.44,21.46
  Bottom 0.152: v59.44,21.46 59.44,15.62 59.69,15.37 IC3.7 | v59.44,36.07 65.02,41.66 65.02,66.42 66.93,68.33 U$1.P$36
PB13  (via drill 0.33)
  Top 0.152: U$1.P$37 71.25,69.6 71.25,50.29 82.93,38.61 v82.93,36.32 82.93,31.5 v79.5,28.07
  Bottom 0.152: v79.5,28.07 78.87,27.43 75.69,27.43 64.9,16.64 IC3.8 | IC4.8 v82.93,36.32
PB14  (via drill 0.33)
  Top 0.152: U$1.P$38 68.33,71.75 68.33,76.2 69.22,77.09 71.75,77.09 73.15,78.49 v74.04,78.49 | B_CONN2.5 117.98,19.94 117.98,8.64 v117.6,8.26
  Bottom 0.152: v74.04,78.49 112.14,78.49 122.43,68.2 122.43,44.32 122.17,44.32 120.27,42.42 120.27,27.18 120.65,26.8 120.65,21.97 119.89,21.21 B_CONN2.5 | B_CONN1.5 110.36,5.46 110.36,7.24 111.38,8.26 v117.6,8.26
PB15  (via drill 0.33)
  Top 0.152: U$1.P$39 68.71,72.14 v68.71,69.34 | v73.66,36.96 v79.63,36.96 | v76.83,28.07 80.39,31.62 v80.39,35.05
  Bottom 0.152: v76.83,28.07 75.82,28.07 65.66,17.91 IC3.9 | 82.3,36.96 v80.39,35.05 | IC4.9 82.93,37.59 82.3,36.96 | v79.63,36.96 82.3,36.96 | v68.71,69.34 68.71,68.33 65.41,65.02 65.41,37.85 66.29,36.96 v73.66,36.96
PC13
  Bottom 0.152: IC4.2 72.77,28.7 70.48,26.42 25.91,26.42 23.37,28.96 19.18,28.96 17.53,30.61 17.53,36.96 U$1.P$62
PC14  (via drill 0.33)
  Top 0.152: v25.27,29.59 19.56,35.31 U$1.P$59
  Bottom 0.152: v25.27,29.59 28.07,26.8 70.36,26.8 72.9,29.34 84.07,29.34 84.71,29.97 IC4.3
PD10  (via drill 0.33)
  Top 0.152: v58.55,36.07 v58.55,21.46 | U$1.P$42 66.93,75.95 63.37,72.39 v63.37,68.96
  Bottom 0.152: v58.55,21.46 58.55,15.24 59.56,14.22 60.63,14.22 IC3.6 | v63.37,68.96 63.37,41.15 58.55,36.32 v58.55,36.07
PE4  (via drill 0.33)
  Top 0.152: v37.59,32.89 v39.37,32.89 | v41.27,32.89 56.64,32.89 v57.53,33.78
  Bottom 0.152: v39.37,32.89 v41.27,32.89 | v57.53,33.78 IC4.6 | U$1.P$63 26.67,32.89 v37.59,32.89
PE5  (via drill 0.33)
  Top 0.152: v56.9,34.42 v41.53,34.42
  Bottom 0.152: v41.53,34.42 37.47,34.42 20.45,51.44 16.26,51.44 15.75,50.93 15.75,41.27 U$1.P$64 | v56.9,34.42 84.07,34.42 84.71,35.05 IC4.7
SCS_D0  (via drill 0.33)
  Top 0.152: v102.49,55.37 113.28,55.37 117.35,59.44 119.89,59.44 CONN_SCS.3
  Bottom 0.152: U$1.P$26 68.33,56.52 74.55,56.52 75.56,55.5 102.36,55.5 v102.49,55.37
SCS_D1
  Bottom 0.152: U$1.P$27 72.9,61.09 91.19,61.09 91.69,61.59 117.35,61.59 118.36,60.58 CONN_SCS.4
SCS_D2  (via drill 0.33)
  Top 0.152: v102.23,57.02 v108.33,63.12
  Bottom 0.152: U$1.P$28 67.44,57.66 68.2,56.9 74.8,56.9 75.82,55.88 101.09,55.88 v102.23,57.02 | v108.33,63.12 115.82,63.12 117.09,64.39 117.09,65.79 118.11,66.8 119.38,66.8 119.89,66.29 119.89,64.26 CONN_SCS.5
SCS_D3
  Bottom 0.152: U$1.P$29 70.99,61.72 91.31,61.72 91.57,61.98 117.35,61.98 CONN_SCS.6
SCS_D4  (via drill 0.33)
  Top 0.152: v81.66,41.78 v98.42,41.78
  Bottom 0.152: v81.66,41.78 66.8,41.78 66.55,42.04 66.55,59.82 U$1.P$30 | v98.42,41.78 100.84,41.78 118.62,59.56 121.41,59.56 122.05,60.2 122.05,65.02 121.41,65.66 CONN_SCS.7
SCS_D5
  Bottom 0.152: U$1.P$31 71.12,62.1 90.93,62.1 91.19,62.36 115.82,62.36 118.49,65.02 CONN_SCS.8
SCS_D6  (via drill 0.33)
  Top 0.152: v81.28,64.77 84.07,64.77 89.03,69.72 v92.96,69.72 | v116.97,69.72 119.51,69.72 CONN_SCS.9
  Bottom 0.152: U$1.P$32 68.96,64.77 v81.28,64.77 | v116.97,69.72 v92.96,69.72
SCS_D7  (via drill 0.33)  (1 unrouted)
  Top 0.152: v75.56,65.53 78.36,65.53 80.14,63.75 84.96,63.75 v86.23,65.02
  Bottom 0.152: v86.23,65.02 115.32,65.02 CONN_SCS.10 | v75.56,65.53 70.23,65.53 U$1.P$33

### Text on the board
tPlace: MuteBox Main PCB v1.0 / (c) Eran Rundstein, 2014
bPlace: MuteBox Main PCB v1.0 / (c) Eran Rundstein, 2014 | 3.3V | 5V